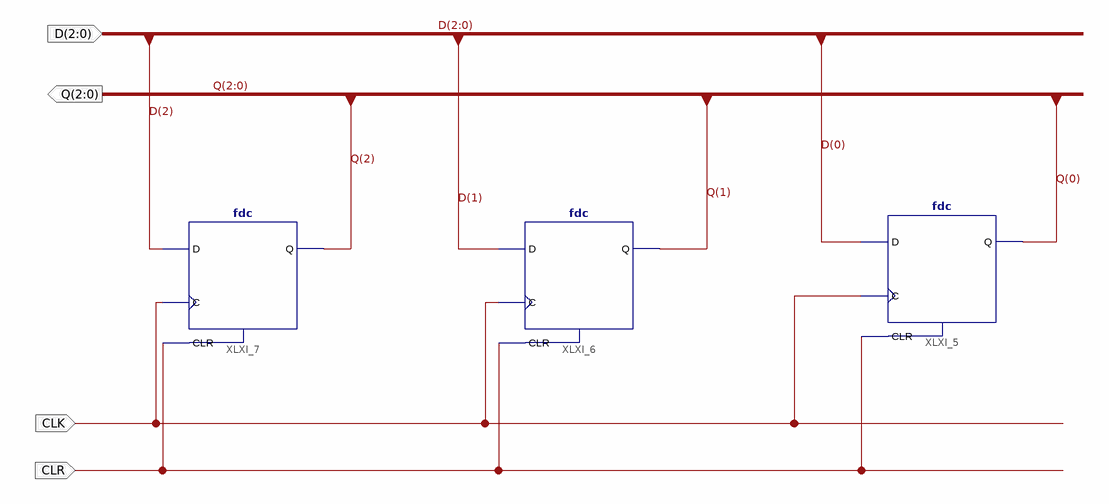
[diagram p0: schematic sheet 1]
// Xilinx ISE schematic PC_new.sch (spartan3e) as structural Verilog: 3 symbols, 4 ports
module PC_new (
  input  [2:0] D,
  input  CLK,
  input  CLR,
  output [2:0] Q
);

  fdc XLXI_5 (.C(CLK), .CLR(CLR), .D(D[0]), .Q(Q[0]));
  fdc XLXI_6 (.C(CLK), .CLR(CLR), .D(D[1]), .Q(Q[1]));
  fdc XLXI_7 (.C(CLK), .CLR(CLR), .D(D[2]), .Q(Q[2]));
endmodule
